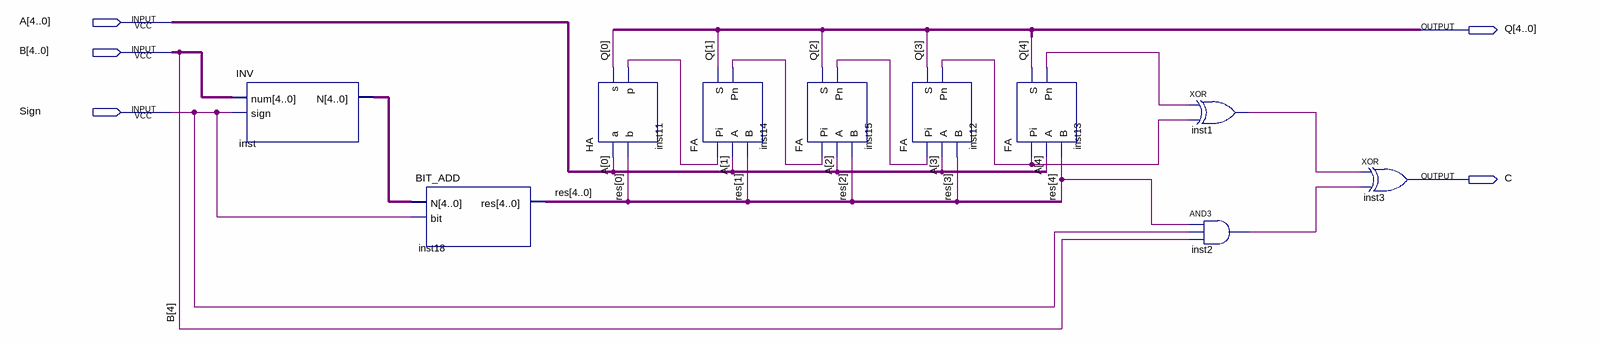
[diagram p0: schematic sheet]
// Quartus schematic lab_test.bdf as structural Verilog: 10 symbols, 5 pins
module lab_test (
  input  [4:0] A,
  input  [4:0] B,
  input  Sign,
  output [4:0] Q,
  output C
);

  wire inst1_out, inst2_out, inst11_p, inst12_pn, inst13_pn, inst14_pn, inst15_pn;
  wire [4:0] inst_n, res;

  INV inst (.num(B), .sign(Sign), .N(inst_n));
  BIT_ADD inst18 (.N(inst_n), .\bit (Sign), .res(res));
  HA inst11 (.a(A[0]), .b(res[0]), .s(Q[0]), .p(inst11_p));
  FA inst14 (.Pi(inst11_p), .A(A[1]), .B(res[1]), .S(Q[1]), .Pn(inst14_pn));
  FA inst15 (.Pi(inst14_pn), .A(A[2]), .B(res[2]), .S(Q[2]), .Pn(inst15_pn));
  FA inst12 (.Pi(inst15_pn), .A(A[3]), .B(res[3]), .S(Q[3]), .Pn(inst12_pn));
  FA inst13 (.Pi(inst12_pn), .A(A[4]), .B(res[4]), .S(Q[4]), .Pn(inst13_pn));
  xor inst1 (inst1_out, inst13_pn, inst12_pn);
  and inst2 (inst2_out, res[4], Sign, B[4]);
  xor inst3 (C, inst1_out, inst2_out);
endmodule
